# EAGLE design Amiga_500_ROM_Adapter_Rev1 (EAGLE 9.7.0)
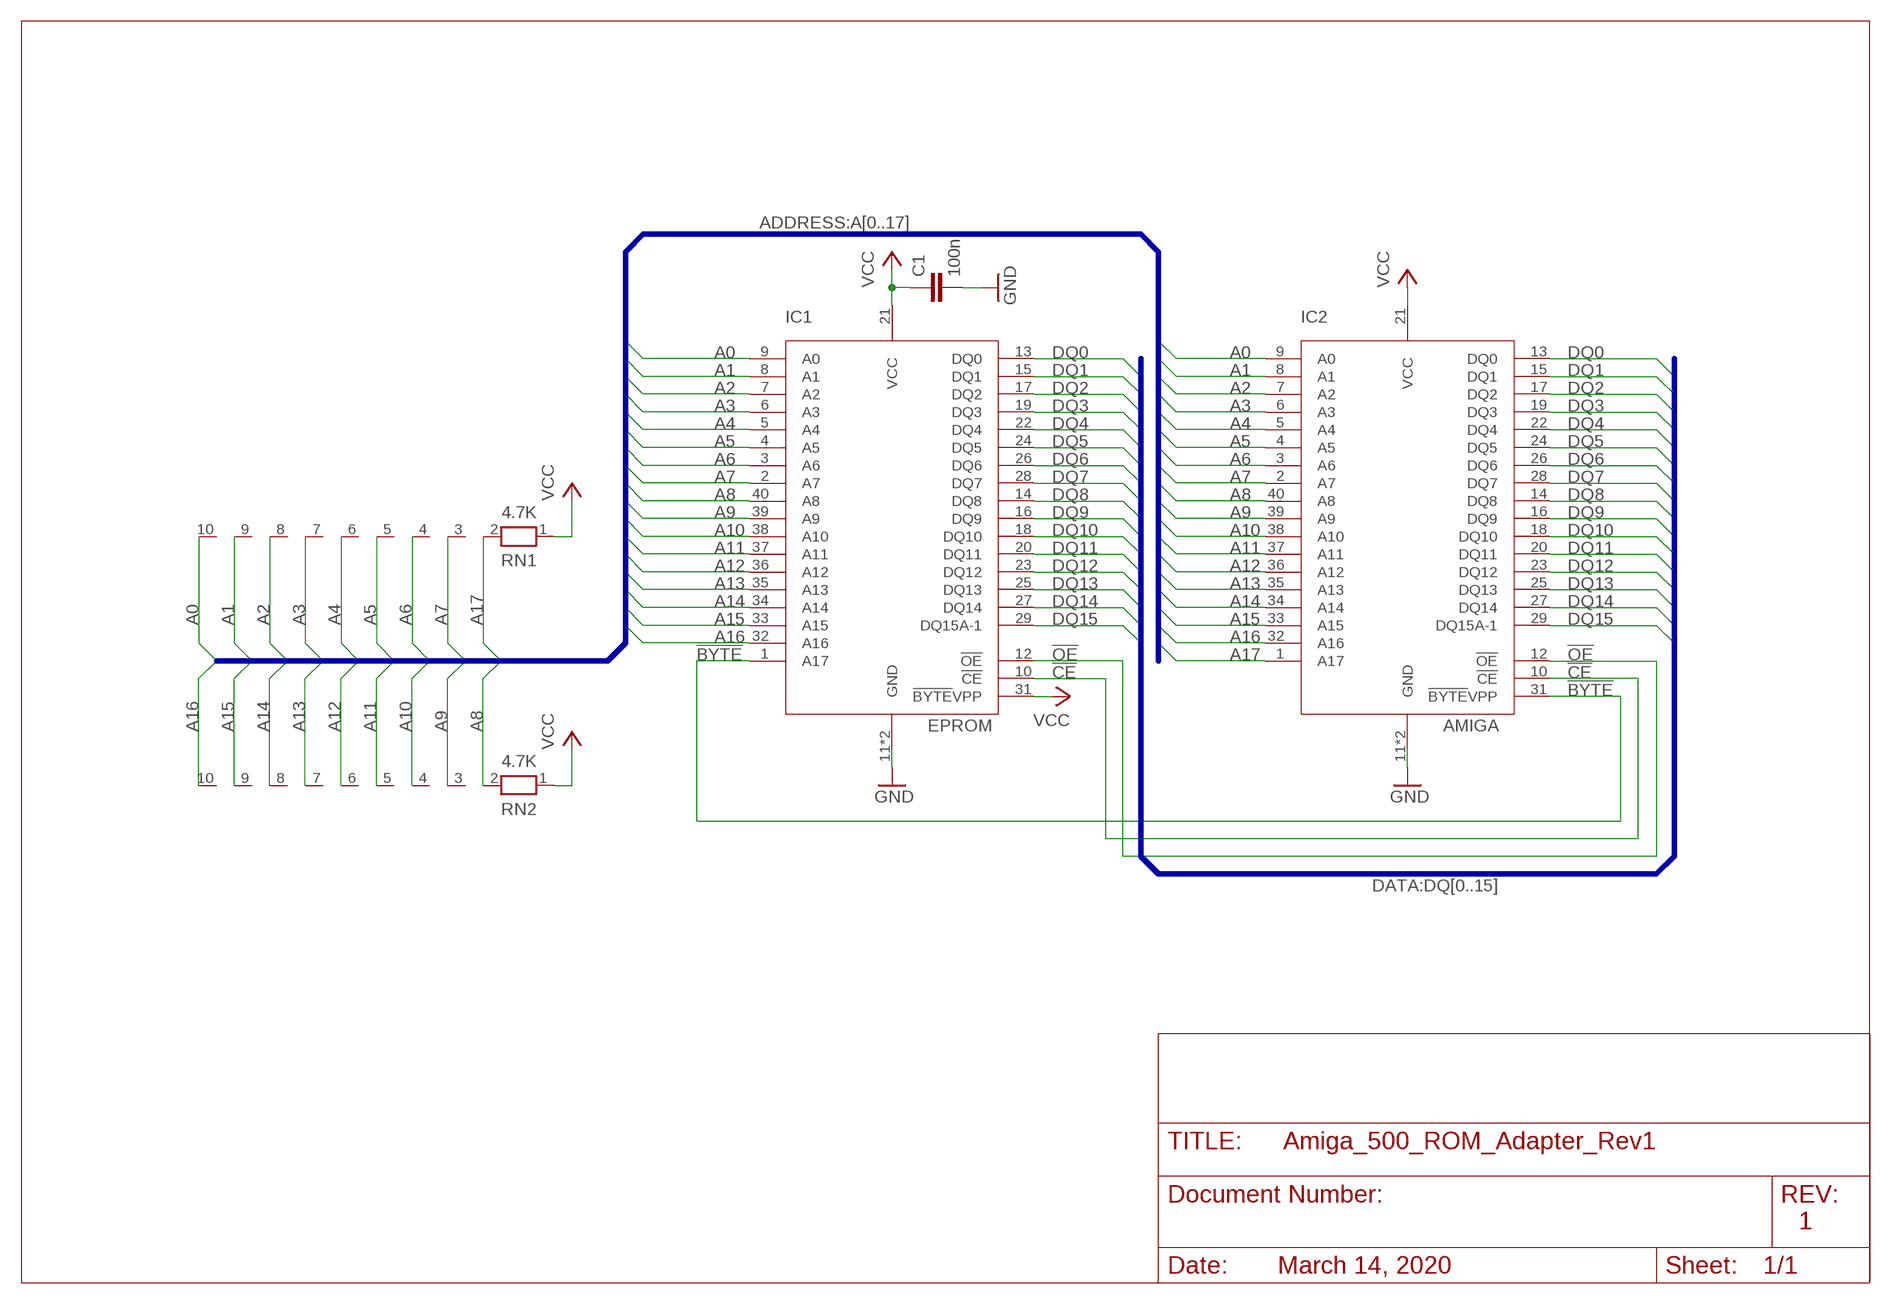
[diagram p0: schematic, sheet 1]

## Parts
C1  100n  C-EU025-025X050  [C025-025X050]
IC1  EPROM  27C400  [DIL40-6]
IC2  AMIGA  27C400  [DIL40-6]
RN1  4.7K  RN09  [RN-10]
RN2  4.7K  RN09  [RN-10]

## Nets
!BYTE: IC1.1(A17) IC2.31(!BYTE!VPP)
!CE: IC1.10(!CE) IC2.10(!CE)
!OE: IC1.12(!OE) IC2.12(!OE)
A0: IC1.9(A0) IC2.9(A0) RN1.10
A1: IC1.8(A1) IC2.8(A1) RN1.9
A2: IC1.7(A2) IC2.7(A2) RN1.8
A3: IC1.6(A3) IC2.6(A3) RN1.7
A4: IC1.5(A4) IC2.5(A4) RN1.6
A5: IC1.4(A5) IC2.4(A5) RN1.5
A6: IC1.3(A6) IC2.3(A6) RN1.4
A7: IC1.2(A7) IC2.2(A7) RN1.3
A8: IC1.40(A8) IC2.40(A8) RN2.2
A9: IC1.39(A9) IC2.39(A9) RN2.3
A10: IC1.38(A10) IC2.38(A10) RN2.4
A11: IC1.37(A11) IC2.37(A11) RN2.5
A12: IC1.36(A12) IC2.36(A12) RN2.6
A13: IC1.35(A13) IC2.35(A13) RN2.7
A14: IC1.34(A14) IC2.34(A14) RN2.8
A15: IC1.33(A15) IC2.33(A15) RN2.9
A16: IC1.32(A16) IC2.32(A16) RN2.10
A17: IC2.1(A17) RN1.2
DQ0: IC1.13(DQ0) IC2.13(DQ0)
DQ1: IC1.15(DQ1) IC2.15(DQ1)
DQ2: IC1.17(DQ2) IC2.17(DQ2)
DQ3: IC1.19(DQ3) IC2.19(DQ3)
DQ4: IC1.22(DQ4) IC2.22(DQ4)
DQ5: IC1.24(DQ5) IC2.24(DQ5)
DQ6: IC1.26(DQ6) IC2.26(DQ6)
DQ7: IC1.28(DQ7) IC2.28(DQ7)
DQ8: IC1.14(DQ8) IC2.14(DQ8)
DQ9: IC1.16(DQ9) IC2.16(DQ9)
DQ10: IC1.18(DQ10) IC2.18(DQ10)
DQ11: IC1.20(DQ11) IC2.20(DQ11)
DQ12: IC1.23(DQ12) IC2.23(DQ12)
DQ13: IC1.25(DQ13) IC2.25(DQ13)
DQ14: IC1.27(DQ14) IC2.27(DQ14)
DQ15: IC1.29(DQ15A-1) IC2.29(DQ15A-1)
GND: C1.2 IC1.11(GND) IC1.30(GND) IC2.11(GND) IC2.30(GND)
VCC: C1.1 IC1.21(VCC) IC1.31(!BYTE!VPP) IC2.21(VCC) RN1.1 RN2.1

## Buses
ADDRESS:A[0..17]
DATA:DQ[0..15]

## Notes on the sheet
- 1
- March 14, 2020

## Library data of the parts
C1 = rcl:C-EU: CAPACITOR, European symbol; SPICEPREFIX: C
IC1 IC2 = _Per.0d91d2b4-203c-4ca7-beb3-502db227b594.flbr:27C400
RN1 RN2 = resistor-net:RN09: RESISTOR NETWORK; OC_FARNELL: unknown; OC_NEWARK: unknown

## Board
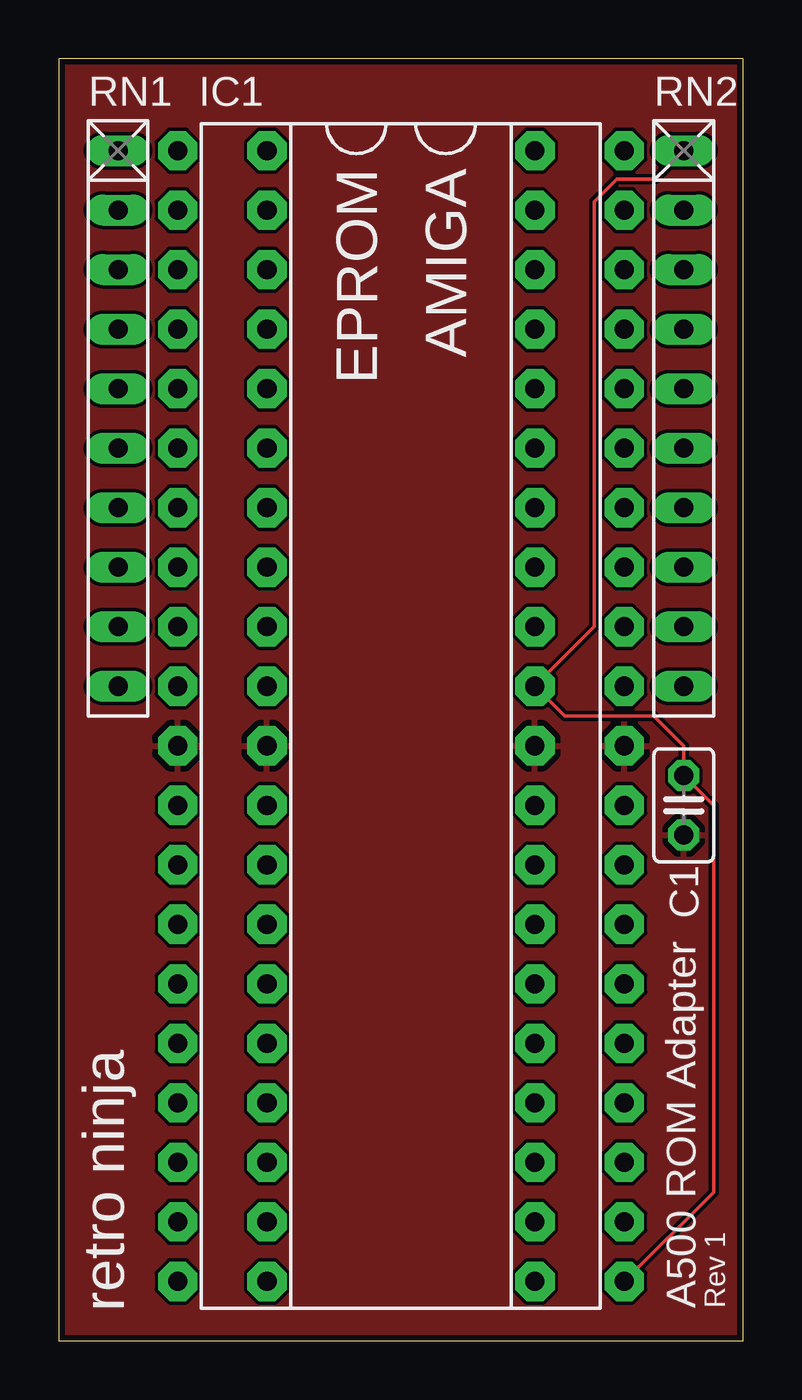
[diagram p1: board, top side]
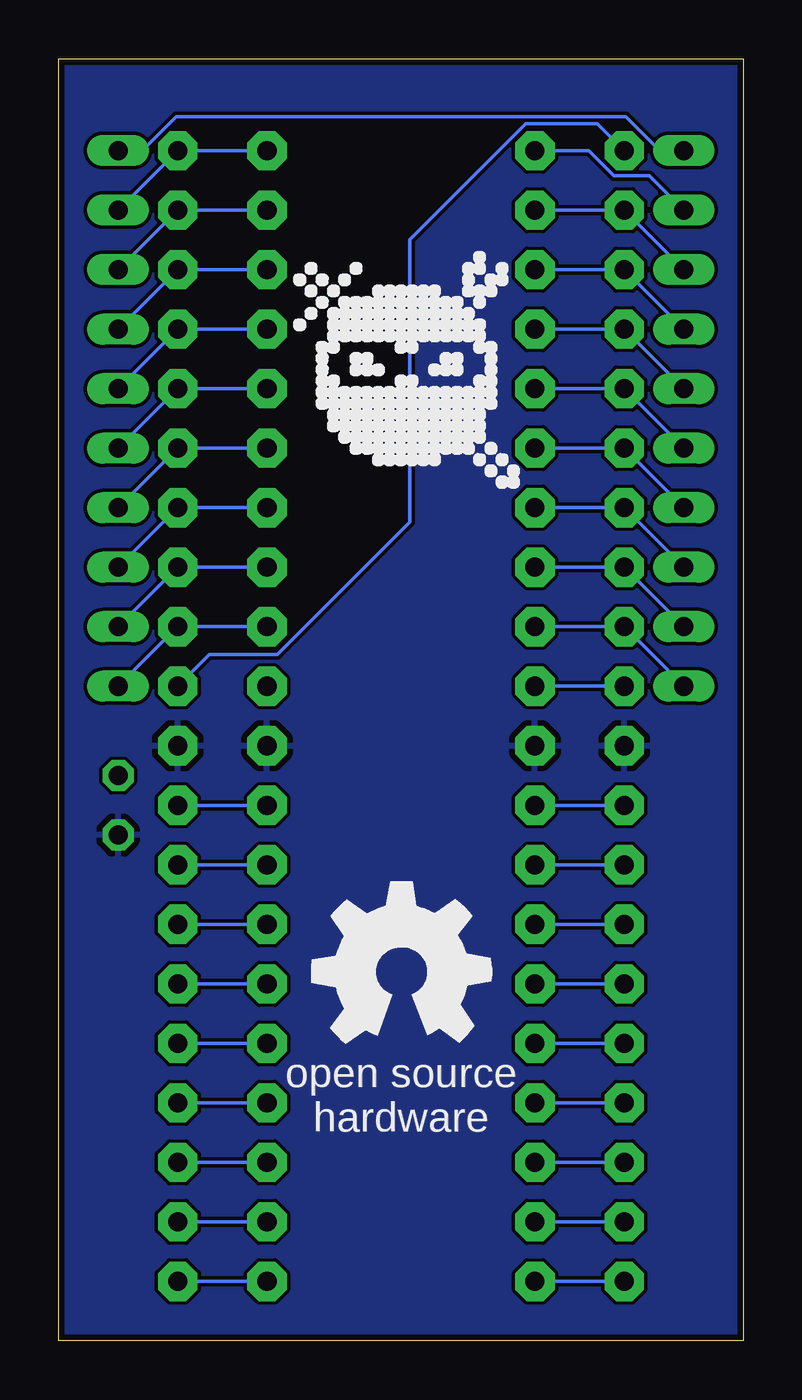
[diagram p2: board, bottom side, seen from below]

Size 29.21 x 54.73 mm. Coordinates in mm from the lower left corner, seen from the top.
Outline: 0,0 29.21,0 29.21,54.73 0,54.73 0,0
Copper layers (1*16): Top 0.035mm / dielectric 1.5mm / Bottom 0.035mm
Design rules "SeeedStudio_2layer_DRU_no_angle_20140221": minimum track width 6mil, minimum drill 12mil, track to track 6mil, track to pad 6mil, pad to pad 6mil, via to via 6mil, smd to smd 0mil, copper to edge 10mil, drill to drill 10mil, minimum pad ring 10mil, minimum via ring 6mil, stop-mask expansion 2mil, vias tented up to drill 100mil, thermal gap 10mil

### Footprints (pad centres in the part's own frame; a part is rotated, then mirrored left to right if it is on the bottom)
C025-025X050 = drill 0.813 octagon: 1 -1.27,0; 2 1.27,0
DIL40-6 = drill 0.813 pad 1.676 octagon: 1 -22.86,-7.62; 2 -20.32,-7.62; 3 -17.78,-7.62; 4 -15.24,-7.62; 5 -12.7,-7.62; 6 -10.16,-7.62; 7 -7.62,-7.62; 8 -5.08,-7.62; 9 -2.54,-7.62; 10 0,-7.62; 11 2.54,-7.62; 12 5.08,-7.62; 13 7.62,-7.62; 14 10.16,-7.62; 15 12.7,-7.62; 16 15.24,-7.62; 17 17.78,-7.62; 18 20.32,-7.62; 19 22.86,-7.62; 20 25.4,-7.62; 21 25.4,7.62; 22 22.86,7.62; 23 20.32,7.62; 24 17.78,7.62; 25 15.24,7.62; 26 12.7,7.62; 27 10.16,7.62; 28 7.62,7.62; 29 5.08,7.62; 30 2.54,7.62; 31 0,7.62; 32 -2.54,7.62; 33 -5.08,7.62; 34 -7.62,7.62; 35 -10.16,7.62; 36 -12.7,7.62; 37 -15.24,7.62; 38 -17.78,7.62; 39 -20.32,7.62; 40 -22.86,7.62
RN-10 = drill 0.813 long: 1 -11.43,0; 2 -8.89,0; 3 -6.35,0; 4 -3.81,0; 5 -1.27,0; 6 1.27,0; 7 3.81,0; 8 6.35,0; 9 8.89,0; 10 11.43,0

### Placement (x,y rotation side)
C1  26.67,22.86 270 top
E$1  [OSHW_8MM]  14.61,15.75 0 bottom
IC1  12.7,27.94 270 top
IC2  16.51,27.94 270 top
RN1  2.54,39.37 270 top
RN2  26.67,39.37 270 top
U$1  [RETRONINJA_NOTEXT_10MM]  19.13,36.45 0 bottom

### Tracks (layer width: path | path; a pad name or v marks a point on that pad's centre or on a via)
!BYTE
  Bottom 0.152: IC1.1 6.22,51.94 9.27,51.94 14.22,46.99 14.22,34.94 19.88,29.29 22.78,29.29 IC2.31
!CE
  Bottom 0.152: IC1.10 IC2.10
!OE
  Bottom 0.152: IC1.12 IC2.12
A0
  Bottom 0.152: RN1.10 IC1.9 IC2.9
A1
  Bottom 0.152: RN1.9 IC1.8 IC2.8
A2
  Bottom 0.152: RN1.8 IC1.7 IC2.7
A3
  Bottom 0.152: RN1.7 IC1.6 IC2.6
A4
  Bottom 0.152: RN1.6 IC1.5 IC2.5
A5
  Bottom 0.152: RN1.5 IC1.4 IC2.4
A6
  Bottom 0.152: RN1.4 IC1.3 IC2.3
A7
  Bottom 0.152: RN1.3 IC1.2 IC2.2
A8
  Bottom 0.152: IC1.40 IC2.40 RN2.2
A9
  Bottom 0.152: IC1.39 IC2.39 RN2.3
A10
  Bottom 0.152: IC1.38 IC2.38 RN2.4
A11
  Bottom 0.152: IC1.37 IC2.37 RN2.5
A12
  Bottom 0.152: IC1.36 IC2.36 RN2.6
A13
  Bottom 0.152: IC1.35 IC2.35 RN2.7
A14
  Bottom 0.152: IC1.34 IC2.34 RN2.8
A15
  Bottom 0.152: IC1.33 IC2.33 RN2.9
A16
  Bottom 0.152: IC1.32 IC2.32 RN2.10
A17
  Bottom 0.152: RN1.2 4.01,49.73 5.52,49.73 6.59,50.8 IC2.1
DQ0
  Bottom 0.152: IC1.13 IC2.13
DQ1
  Bottom 0.152: IC1.15 IC2.15
DQ2
  Bottom 0.152: IC1.17 IC2.17
DQ3
  Bottom 0.152: IC1.19 IC2.19
DQ4
  Bottom 0.152: IC1.22 IC2.22
DQ5
  Bottom 0.152: IC1.24 IC2.24
DQ6
  Bottom 0.152: IC1.26 IC2.26
DQ7
  Bottom 0.152: IC1.28 IC2.28
DQ8
  Bottom 0.152: IC1.14 IC2.14
DQ9
  Bottom 0.152: IC1.16 IC2.16
DQ10
  Bottom 0.152: IC1.18 IC2.18
DQ11
  Bottom 0.152: IC1.20 IC2.20
DQ12
  Bottom 0.152: IC1.23 IC2.23
DQ13
  Bottom 0.152: IC1.25 IC2.25
DQ14
  Bottom 0.152: IC1.27 IC2.27
DQ15
  Bottom 0.152: IC1.29 IC2.29
GND
  pour Top: 0,0 29.21,0 29.21,54.61 0,54.61
  pour Bottom: 0,-1.27 29.21,-1.27 29.21,54.61 0,54.61
VCC
  Top 0.152: RN2.1 25.45,49.58 23.82,49.58 22.86,48.63 22.86,30.48 IC1.31 21.59,26.67 25.4,26.67 26.67,25.4 C1.1 27.94,22.86 27.94,6.35 IC2.21
  Bottom 0.152: RN1.1 3.57,50.8 5.02,52.25 24.19,52.25 25.64,50.8 RN2.1 | IC1.21 IC2.21

### Text on the board
tPlace: retro ninja | A500 ROM Adapter | Rev 1